# EAGLE schematic Wiring Diagram (EAGLE 8.5.1)
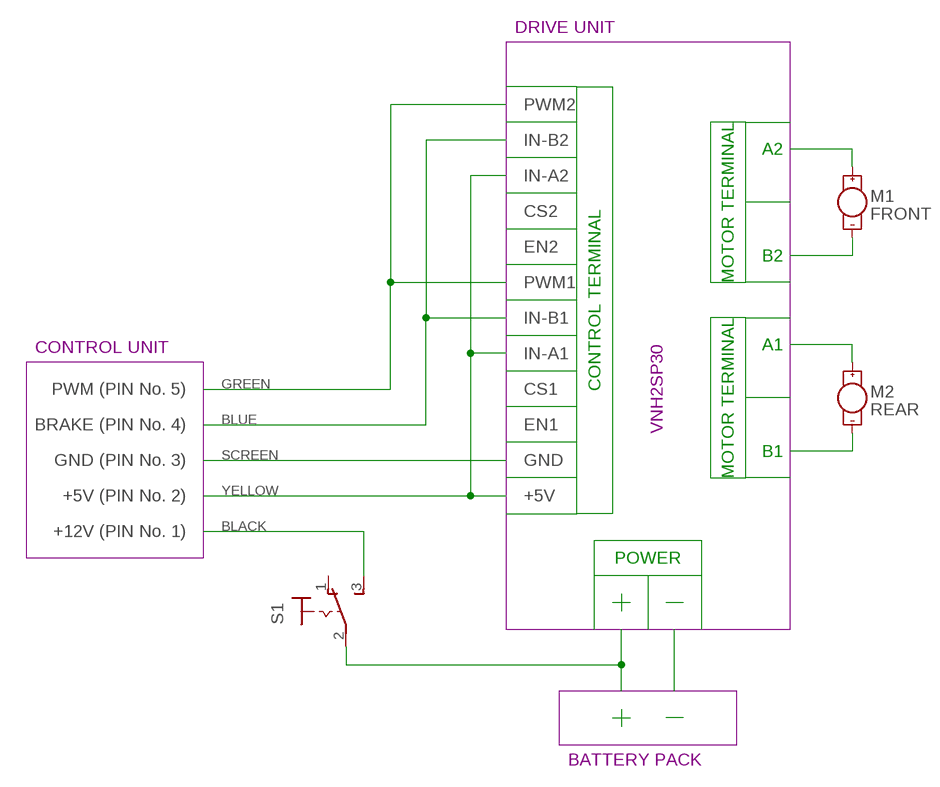
[diagram p0: schematic, sheet 1]

## Parts
M1  FRONT  MOTOR10MM  [VIBE-MOTOR-10MM]
M2  REAR  MOTOR10MM  [VIBE-MOTOR-10MM]
S1  320-916  [320-916]

## Nets
BLACK: S1.3(S)
N$5: M2.+
N$6: M2.-
N$13: S1.2(P)
N$15: M1.+
N$16: M1.-
Unconnected: S1.1(O)

## Notes on the sheet
- DRIVE UNIT
- PWM2
- IN-B2
- A2
- IN-A2
- MOTOR TERMINAL
- CS2
- EN2
- B2
- PWM1
- CONTROL TERMINAL
- IN-B1
- A1
- CONTROL UNIT | IN-A1
- PWM (PIN No. 5) | CS1 | VNH2SP30
- MOTOR TERMINAL
- BRAKE (PIN No. 4) | EN1
- B1
- GND (PIN No. 3) | GND
- +5V (PIN No. 2) | +5V
- +12V (PIN No. 1)
- POWER
- BATTERY PACK

## Library data of the parts
M1 M2 = SparkFun-Electromechanical:MOTOR: Motor (Single-Phase) Two-terminal, single-phase motors. SparkFun Products Vibration Motor <https://www.sparkfun.com/products/8449> (ROB-08449) Physical dimension and wire connections for this powerful vibration motor. Motor has a self adhesive backing.; PROD_ID: COMP-08572; SF_SKU: ROB-08449
S1 = switch:320-916: TOGGLE SWITCH distributor RS Components